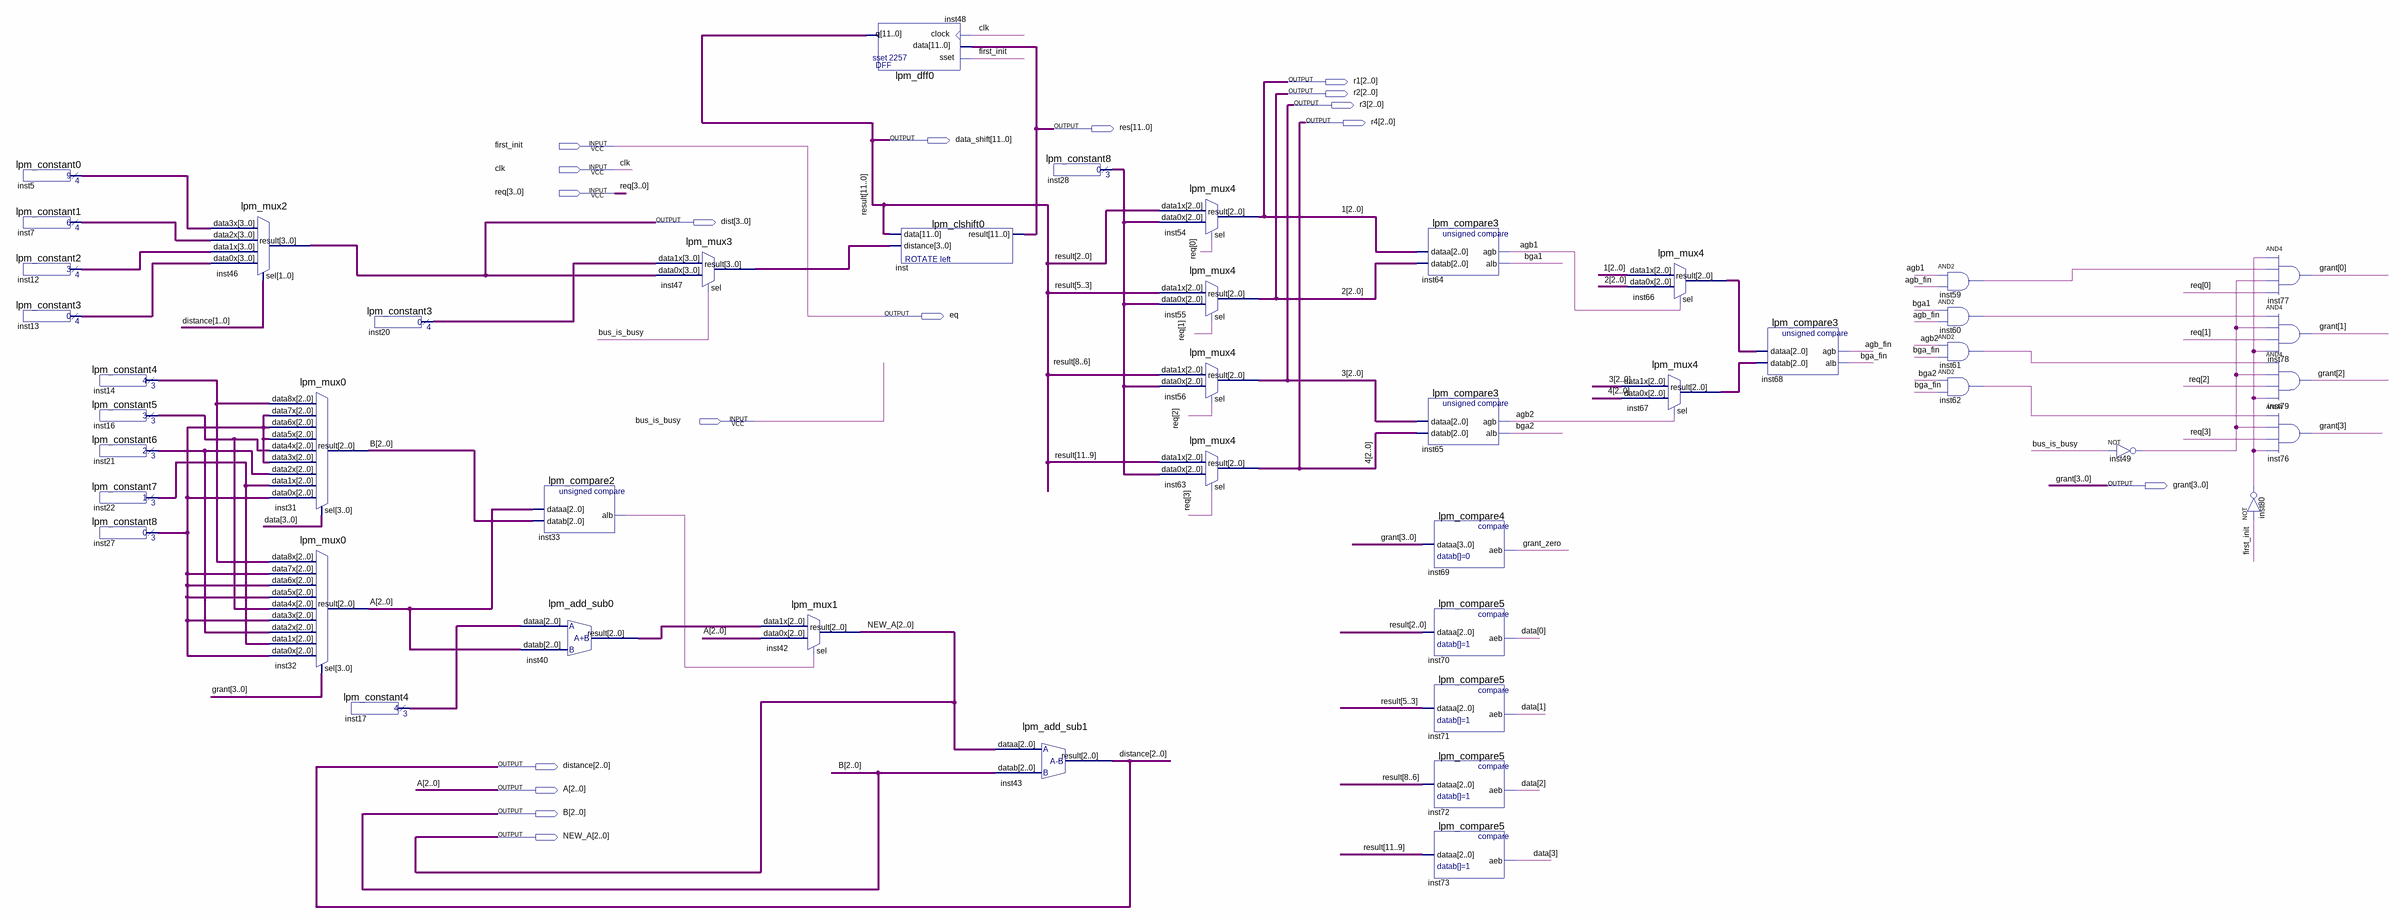
[diagram p0: schematic sheet]
// Quartus schematic arbitr.bdf as structural Verilog: 46 symbols, 17 pins
module arbitr (
  input  first_init,
  input  clk,
  input  [3:0] req,
  input  bus_is_busy,
  output [2:0] r1,
  output [2:0] r2,
  output [2:0] r3,
  output [2:0] r4,
  output [11:0] res,
  output [11:0] data_shift,
  output [3:0] \dist ,
  output eq,
  output [3:0] grant,
  output [2:0] distance,
  output [2:0] A,
  output [2:0] B,
  output [2:0] NEW_A
);

  wire agb1, agb2, agb_fin, bga1, bga2, bga_fin, grant_zero, inst33_alb, inst49_out, inst59_out, inst60_out,
       inst61_out, inst62_out, inst80_out;
  wire [2:0] inst14_result, inst16_result, inst17_result, inst21_result, inst22_result, inst27_result,
       inst28_result, inst40_result, inst66_result, inst67_result;
  wire [3:0] data, inst5_result, inst7_result, inst12_result, inst13_result, inst20_result, inst47_result;

  lpm_constant0 inst5 (.result(inst5_result));
  lpm_constant1 inst7 (.result(inst7_result));
  lpm_constant2 inst12 (.result(inst12_result));
  lpm_constant3 inst13 (.result(inst13_result));
  lpm_constant4 inst14 (.result(inst14_result));
  lpm_constant5 inst16 (.result(inst16_result));
  lpm_constant6 inst21 (.result(inst21_result));
  lpm_constant7 inst22 (.result(inst22_result));
  lpm_constant8 inst27 (.result(inst27_result));
  lpm_mux2 inst46 (
    .data3x(inst5_result), .data2x(inst7_result), .data1x(inst12_result), .data0x(inst13_result),
    .sel(distance[1:0]), .result(\dist ));
  lpm_mux0 inst31 (
    .data8x(inst14_result), .data7x(inst27_result), .data6x(inst27_result), .data5x(inst27_result),
    .data4x(inst16_result), .data3x(inst27_result), .data2x(inst21_result), .data1x(inst22_result),
    .data0x(inst27_result), .sel(data), .result(B));
  lpm_mux0 inst32 (
    .data8x(inst14_result), .data7x(inst27_result), .data6x(inst27_result), .data5x(inst27_result),
    .data4x(inst16_result), .data3x(inst27_result), .data2x(inst21_result), .data1x(inst22_result),
    .data0x(inst27_result), .sel(grant), .result(A));
  lpm_constant4 inst17 (.result(inst17_result));
  lpm_constant3 inst20 (.result(inst20_result));
  lpm_compare2 inst33 (.dataa(A), .datab(B), .alb(inst33_alb));
  lpm_add_sub0 inst40 (.dataa(inst17_result), .datab(A), .result(inst40_result));
  lpm_mux3 inst47 (.data1x(inst20_result), .data0x(\dist ), .sel(bus_is_busy), .result(inst47_result));
  lpm_mux1 inst42 (.data1x(inst40_result), .data0x(A), .sel(inst33_alb), .result(NEW_A));
  lpm_dff0 inst48 (.sset(first_init), .data(res), .clock(clk), .q(data_shift));
  lpm_clshift0 inst (.data(data_shift), .distance(inst47_result), .result(res));
  lpm_add_sub1 inst43 (.dataa(NEW_A), .datab(B), .result(distance));
  lpm_constant8 inst28 (.result(inst28_result));
  lpm_mux4 inst54 (.data1x(data_shift[2:0]), .data0x(inst28_result), .sel(req[0]), .result(r1));
  lpm_mux4 inst55 (.data1x(data_shift[5:3]), .data0x(inst28_result), .sel(req[1]), .result(r2));
  lpm_mux4 inst56 (.data1x(data_shift[8:6]), .data0x(inst28_result), .sel(req[2]), .result(r3));
  lpm_mux4 inst63 (.data1x(data_shift[11:9]), .data0x(inst28_result), .sel(req[3]), .result(r4));
  lpm_compare3 inst64 (.dataa(r1), .datab(r2), .agb(agb1), .alb(bga1));
  lpm_compare3 inst65 (.dataa(r3), .datab(r4), .agb(agb2), .alb(bga2));
  lpm_compare4 inst69 (.dataa(grant), .aeb(grant_zero));
  lpm_compare5 inst70 (.dataa(data_shift[2:0]), .aeb(data[0]));
  lpm_compare5 inst71 (.dataa(data_shift[5:3]), .aeb(data[1]));
  lpm_compare5 inst72 (.dataa(data_shift[8:6]), .aeb(data[2]));
  lpm_compare5 inst73 (.dataa(data_shift[11:9]), .aeb(data[3]));
  lpm_mux4 inst66 (.data1x(r1), .data0x(r2), .sel(agb1), .result(inst66_result));
  lpm_mux4 inst67 (.data1x(r3), .data0x(r4), .sel(agb2), .result(inst67_result));
  lpm_compare3 inst68 (.dataa(inst66_result), .datab(inst67_result), .agb(agb_fin), .alb(bga_fin));
  and inst59 (inst59_out, agb1, agb_fin);
  and inst60 (inst60_out, bga1, agb_fin);
  and inst61 (inst61_out, agb2, bga_fin);
  and inst62 (inst62_out, bga2, bga_fin);
  not inst49 (inst49_out, bus_is_busy);
  and inst77 (grant[0], inst80_out, inst59_out, inst49_out, req[0]);
  and inst78 (grant[1], inst60_out, inst49_out, req[1], inst80_out);
  and inst79 (grant[2], inst61_out, inst49_out, req[2], inst80_out);
  and inst76 (grant[3], inst62_out, inst49_out, req[3], inst80_out);
  not inst80 (inst80_out, first_init);

  assign eq = first_init;

  // Other names for the same wires on the sheet: result[11:0] = data_shift; 1[2:0] = r1; 2[2:0] = r2; 3[2:0] = r3;
  //   4[2:0] = r4
endmodule
